# Altium schematic sheet OverView.SchDoc
size A4; SheetNumber: 1; SheetTotal: 15
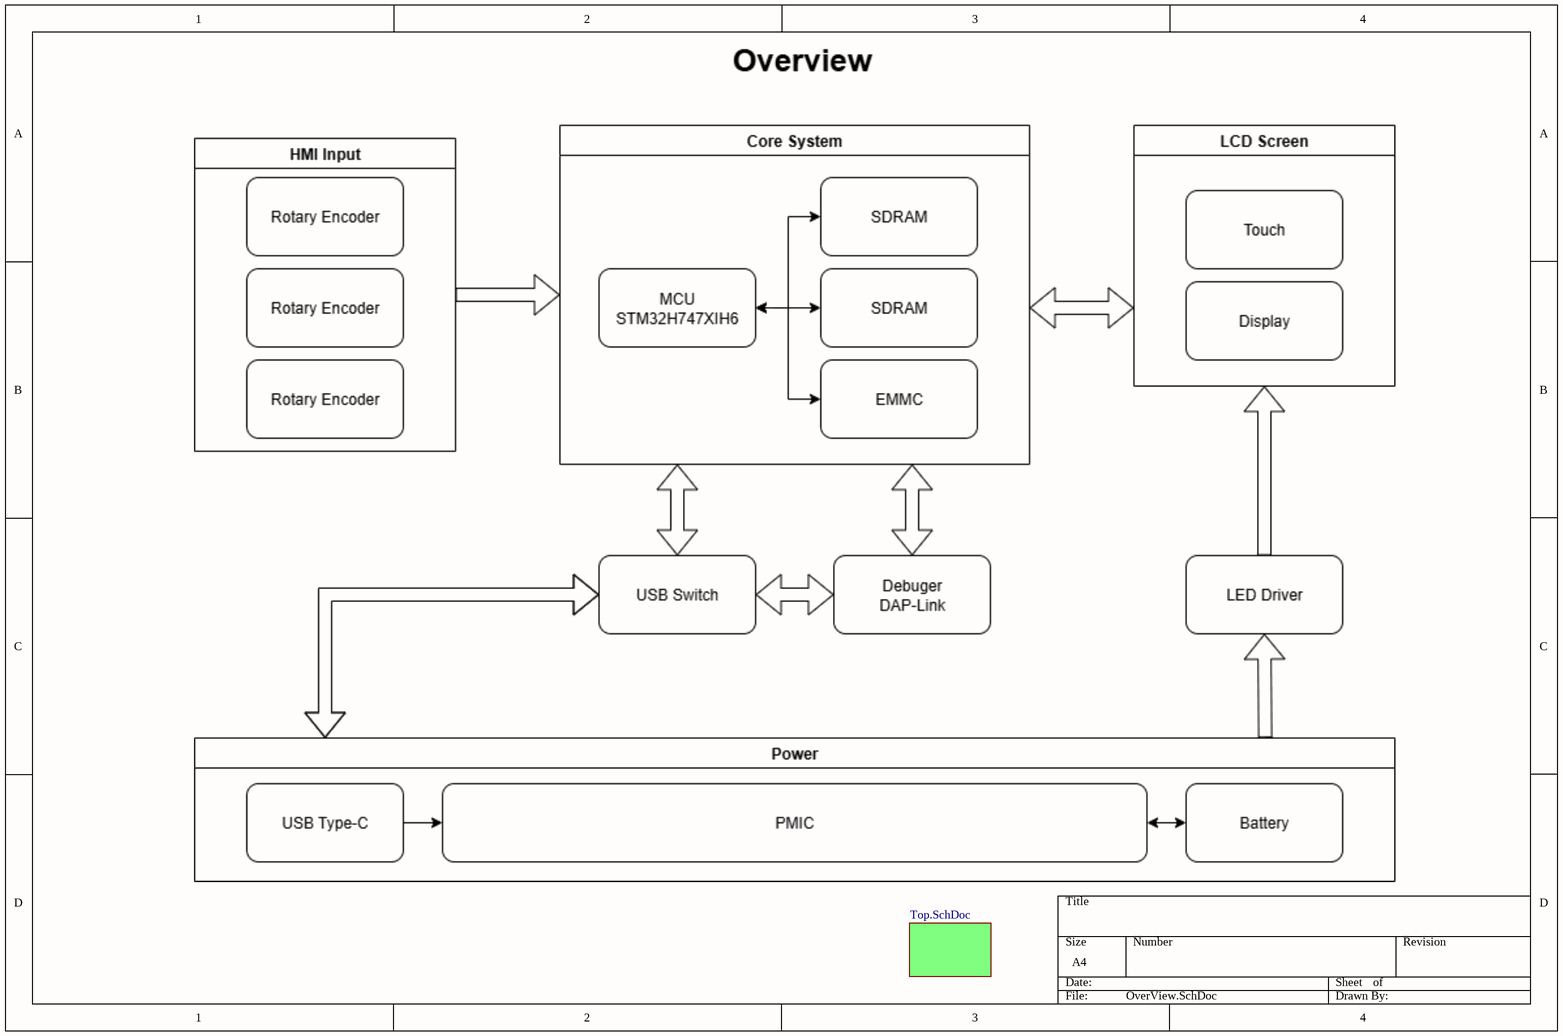
[diagram p0: OverView.SchDoc]

## Sub-sheets
Designator = Top.SchDoc: no entries